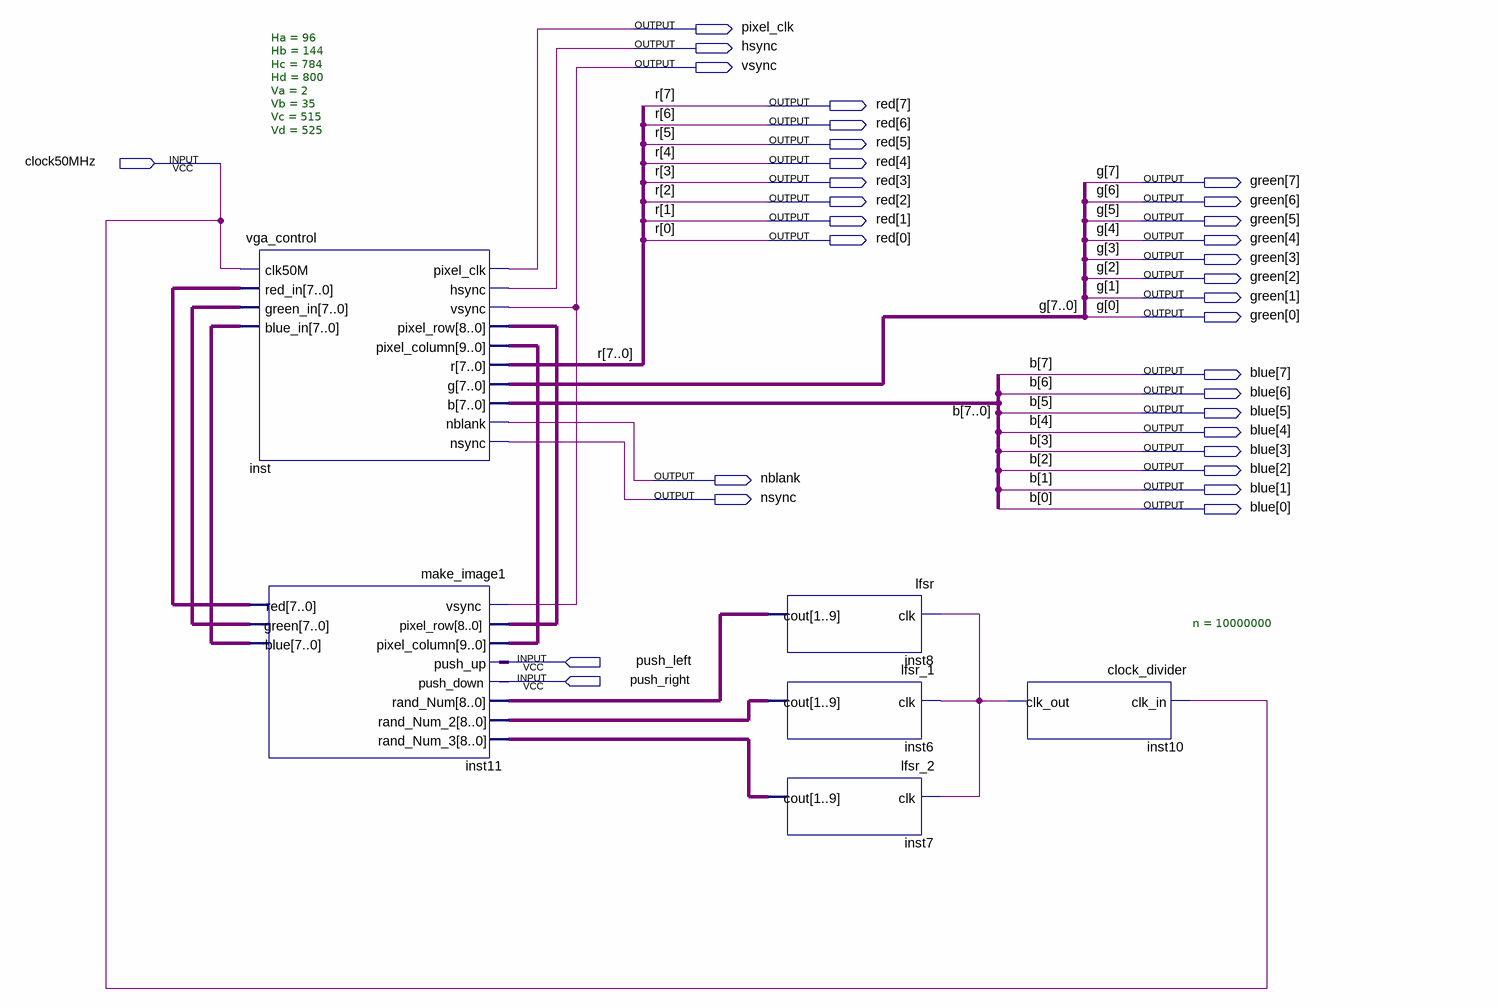
[diagram p0: schematic sheet]
// Quartus schematic VGA_lab.bdf as structural Verilog: 6 symbols, 32 pins
module VGA_lab (
  input  clock50MHz,
  input  push_left,
  input  push_right,
  output pixel_clk,
  output hsync,
  output vsync,
  output [7:0] red,
  output [7:0] green,
  output [7:0] blue,
  output nblank,
  output nsync
);

  wire inst10_clk_out;
  wire [7:0] inst11_blue, inst11_green, inst11_red;
  wire [8:0] inst6_cout, inst7_cout, inst8_cout, inst_pixel_row;
  wire [9:0] inst_pixel_column;

  vga_control #(.Ha(96), .Hb(144), .Hc(784), .Hd(800), .Va(2), .Vb(35), .Vc(515), .Vd(525)) inst (
    .clk50M(clock50MHz), .red_in(inst11_red), .green_in(inst11_green), .blue_in(inst11_blue),
    .pixel_clk(pixel_clk), .hsync(hsync), .vsync(vsync), .pixel_row(inst_pixel_row),
    .pixel_column(inst_pixel_column), .r(red), .g(green), .b(blue), .nblank(nblank), .nsync(nsync));
  make_image1 inst11 (
    .vsync(vsync), .pixel_row(inst_pixel_row), .pixel_column(inst_pixel_column), .push_up(push_left),
    .push_down(push_right), .rand_Num(inst8_cout), .rand_Num_2(inst6_cout), .rand_Num_3(inst7_cout),
    .red(inst11_red), .green(inst11_green), .blue(inst11_blue));
  lfsr inst8 (.clk(inst10_clk_out), .cout(inst8_cout));
  lfsr_1 inst6 (.clk(inst10_clk_out), .cout(inst6_cout));
  lfsr_2 inst7 (.clk(inst10_clk_out), .cout(inst7_cout));
  clock_divider #(.n(10000000)) inst10 (.clk_in(clock50MHz), .clk_out(inst10_clk_out));

  // Other names for the same wires on the sheet: b[7:0] = blue; g[7:0] = green; r[7:0] = red
endmodule
